# EAGLE design RobotBooster (EAGLE 6.4)
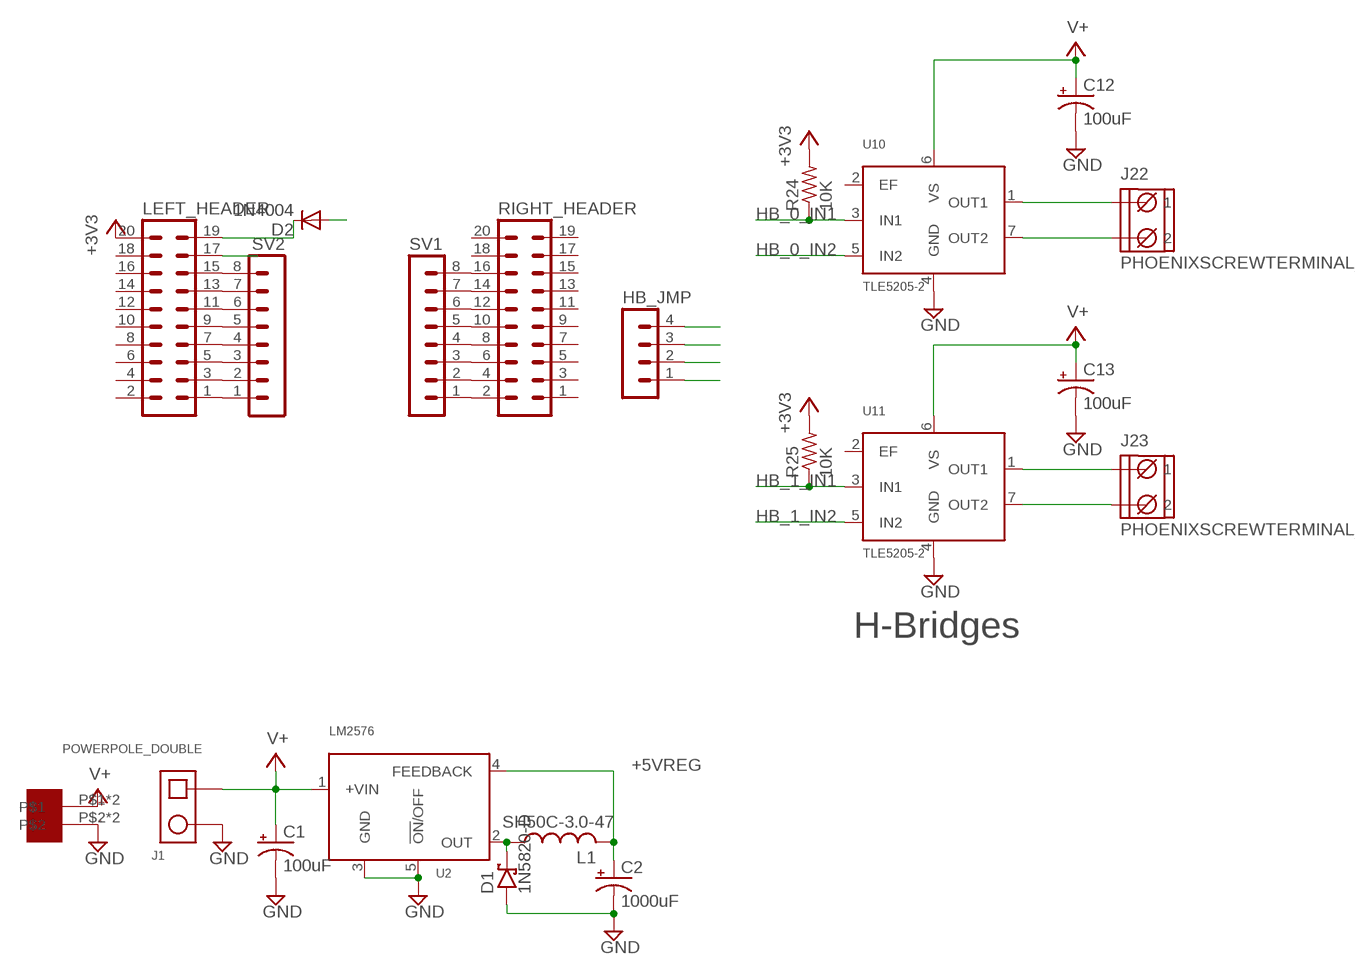
[diagram p0: schematic, sheet 1]

## Parts
C1  100uF  CPOL-USE3.5-8  [E3,5-8]
C2  1000uF  CPOL-USE5-10.5  [E5-10,5]
C12  100uF  CPOL-USE3.5-8  [E3,5-8]
C13  100uF  CPOL-USE3.5-8  [E3,5-8]
D1  1N5820-D  [DIODE_17MM]
D2  1N4004  [DO41-10]
HB_JMP  MA04-1  [MA04-1]
J1  POWERPOLE_DOUBLE  [POWERPOLE_DOUBLE]
J22  PHOENIXSCREWTERMINAL_2  [PHOENIXSCREWTERMINAL_2]
J23  PHOENIXSCREWTERMINAL_2  [PHOENIXSCREWTERMINAL_2]
L1  SH50C-3.0-47  [SH50-C2]
LEFT_HEADER  MA10-2  [MA10-2]
R24  10K  R-US_0204/5  [0204/5]
R25  10K  R-US_0204/5  [0204/5]
RIGHT_HEADER  MA10-2  [MA10-2]
SV1  MA08-1  [MA08-1]
SV2  MA08-1  [MA08-1]
U2  LM2576  [TO-220-5]
U10  TLE5205-2  [TO-220-7-11]
U11  TLE5205-2  [TO-220-7-11]
U$1  .200-2SMD  [HLE-108-02-X-DV-BE-A]

## Nets
+3V3: LEFT_HEADER.20 R24.2 R25.2
+5VREG: C2.+ D2.A L1.P$2 U2.4(FEEDBACK)
GND: C1.- C2.- C12.- C13.- D1.2(A) J1.2 LEFT_HEADER.17 U2.3(GND) U2.5(!ON!/OFF) U10.4(GND) U11.4(GND) U$1.P$2 U$1.P$4
HB_0_IN1: HB_JMP.4 R24.1 U10.3(IN1)
HB_0_IN2: HB_JMP.3 U10.5(IN2)
HB_1_IN1: HB_JMP.2 R25.1 U11.3(IN1)
HB_1_IN2: HB_JMP.1 U11.5(IN2)
N$1: D1.1(C) L1.P$1 U2.2(OUT)
N$2: RIGHT_HEADER.2 SV1.1
N$3: RIGHT_HEADER.4 SV1.2
N$4: RIGHT_HEADER.6 SV1.3
N$5: RIGHT_HEADER.8 SV1.4
N$6: RIGHT_HEADER.10 SV1.5
N$7: RIGHT_HEADER.12 SV1.6
N$8: RIGHT_HEADER.14 SV1.7
N$9: RIGHT_HEADER.16 SV1.8
N$10: LEFT_HEADER.1 SV2.1
N$11: LEFT_HEADER.3 SV2.2
N$12: LEFT_HEADER.5 SV2.3
N$13: LEFT_HEADER.7 SV2.4
N$14: LEFT_HEADER.9 SV2.5
N$15: LEFT_HEADER.11 SV2.6
N$16: LEFT_HEADER.13 SV2.7
N$17: LEFT_HEADER.15 SV2.8
N$18: D2.C LEFT_HEADER.19
N$24: J22.1 U10.1(OUT1)
N$27: J22.2 U10.7(OUT2)
N$28: J23.1 U11.1(OUT1)
N$31: J23.2 U11.7(OUT2)
V+: C1.+ C12.+ C13.+ J1.1 U2.1(+VIN) U10.6(VS) U11.6(VS) U$1.P$1 U$1.P$3
Unconnected: LEFT_HEADER.2 LEFT_HEADER.4 LEFT_HEADER.6 LEFT_HEADER.8 LEFT_HEADER.10 LEFT_HEADER.12 LEFT_HEADER.14 LEFT_HEADER.16 LEFT_HEADER.18 RIGHT_HEADER.1 RIGHT_HEADER.3 RIGHT_HEADER.5 RIGHT_HEADER.7 RIGHT_HEADER.9 RIGHT_HEADER.11 RIGHT_HEADER.13 RIGHT_HEADER.15 RIGHT_HEADER.17 RIGHT_HEADER.18 RIGHT_HEADER.19 RIGHT_HEADER.20 U10.2(EF) U11.2(EF)

## Notes on the sheet
- H-Bridges

## Library data of the parts
C1 C2 C12 C13 = rcl:CPOL-US: POLARIZED CAPACITOR, American symbol
D1 = RASEagleLib:1N5820-D: 1N5820-D Schottky Diode
D2 = diode:1N4004: DIODE general purpose rectifier, 1 A
HB_JMP = con-lstb:MA04-1: PIN HEADER; OC_FARNELL: unknown; OC_NEWARK: unknown
J1 = RASEagleLib:POWERPOLE_DOUBLE: Double PowerPole Connector Good for battery connections.
J22 J23 = RASEagleLib:PHOENIXSCREWTERMINAL_2: Phoenix Screw Terminal 2 contacts, 5 mm pitch Terminal: 1934861 Pins: 1933189
L1 = RASEagleLib:SH50C-3.0-47: Inductor 47uH, 3 A SH50C-3.0-47
LEFT_HEADER RIGHT_HEADER = con-lstb:MA10-2: PIN HEADER; OC_FARNELL: unknown; OC_NEWARK: unknown
R24 R25 = rcl:R-US_: RESISTOR, American symbol
SV1 SV2 = con-lstb:MA08-1: PIN HEADER; OC_FARNELL: unknown; OC_NEWARK: unknown
U2 = RASEagleLib:LM2576: LM2576 Step Down Regulator
U10 U11 = RASEagleLib:TLE5205-2: TLE5205-2 5-A H-Bridge for DC-Motor Applications
U$1 = HPM-02-02-T-S:.200-2SMD

## Board
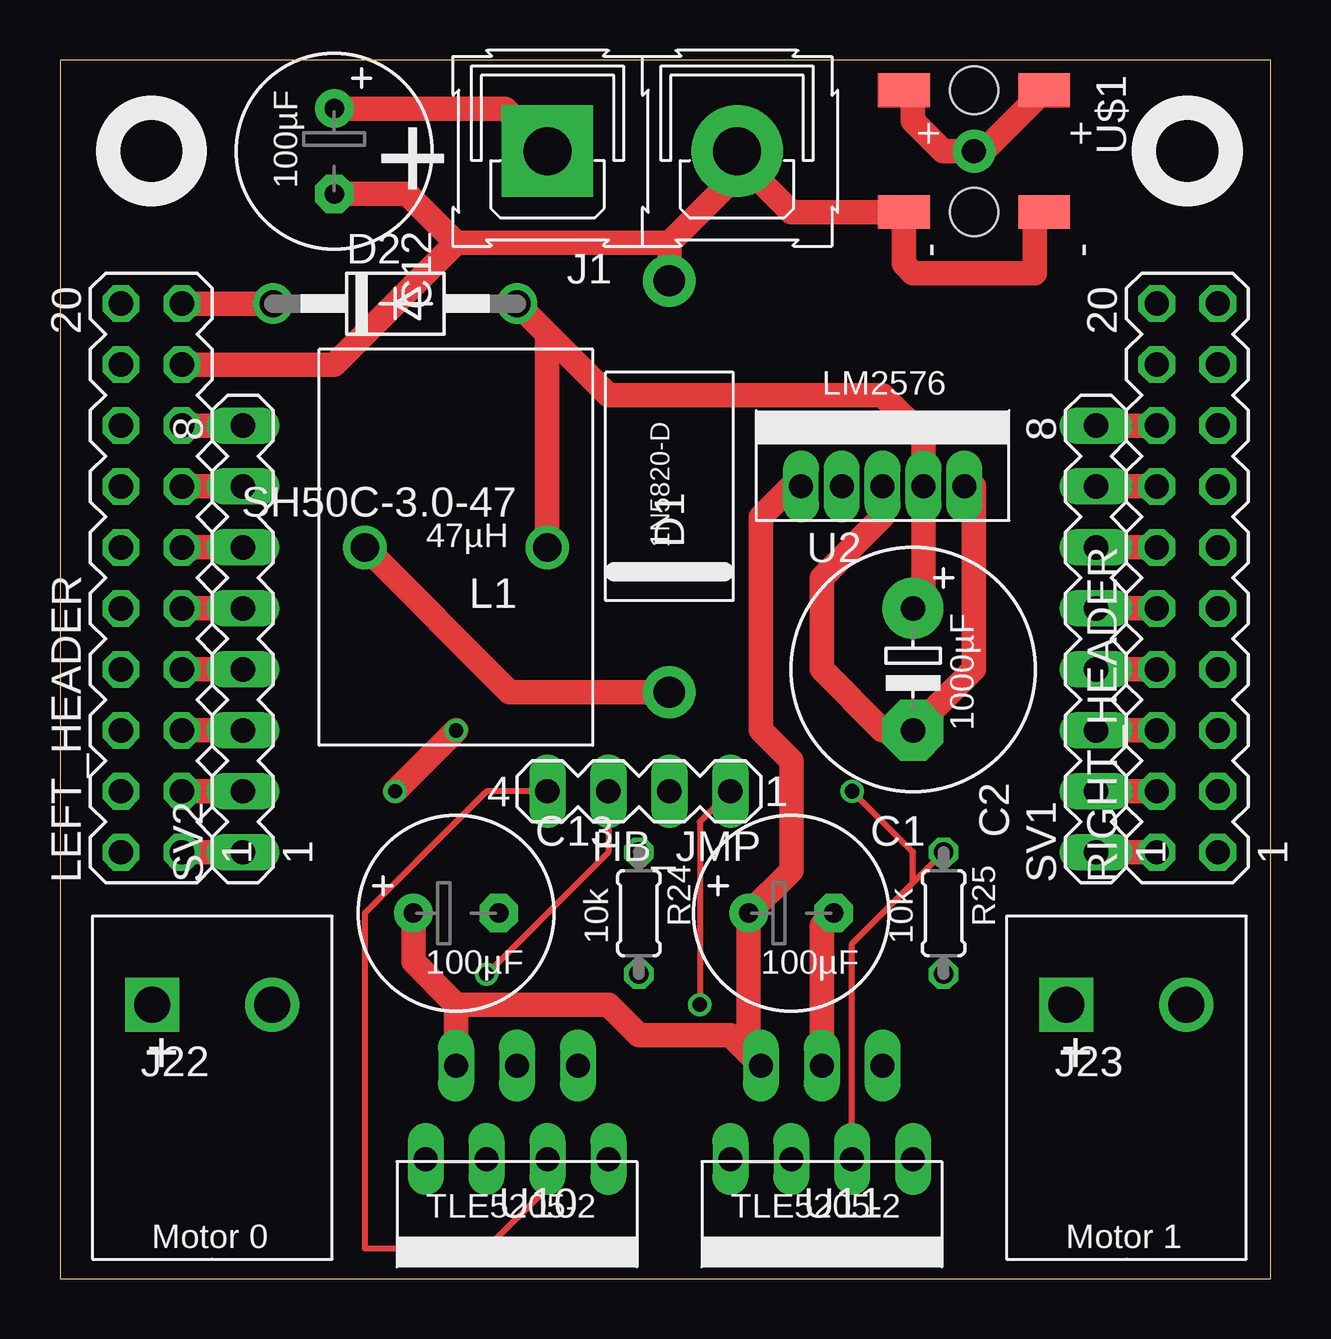
[diagram p1: board, top side]
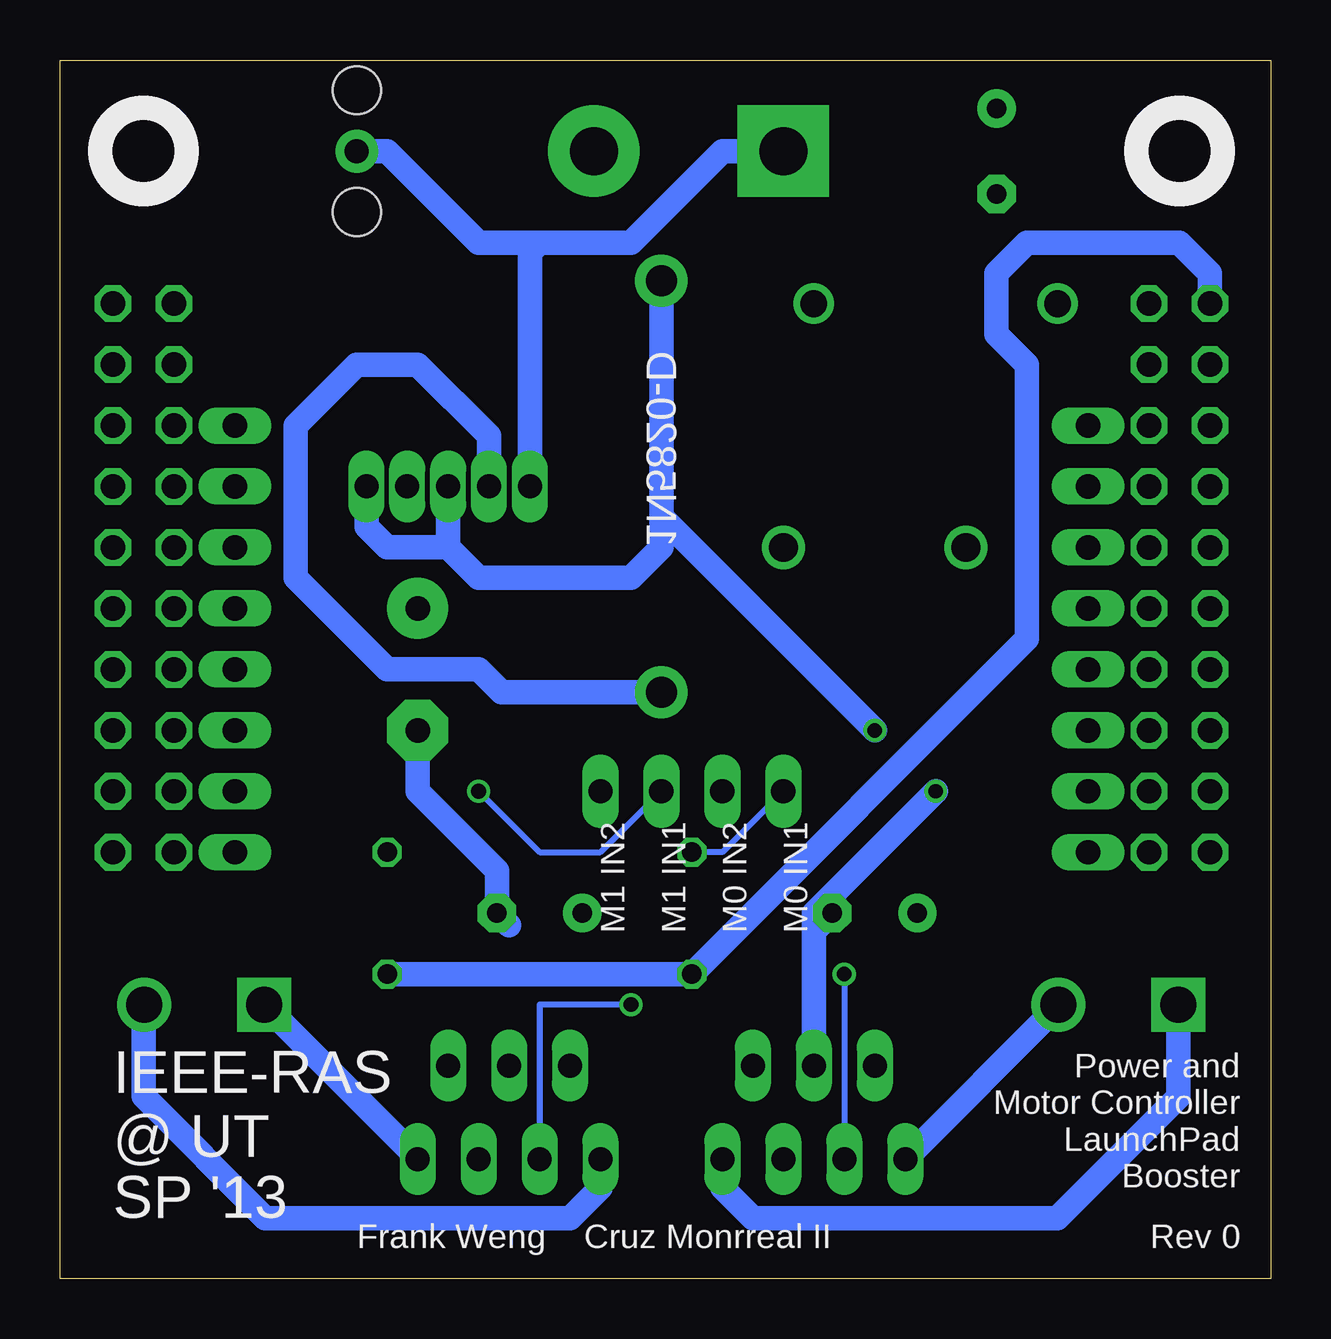
[diagram p2: board, bottom side, seen from below]

Size 50.47 x 50.79 mm. Coordinates in mm from the lower left corner, seen from the top.
Outline: 0,0 50.47,0 50.47,50.79 0,50.79 0,0
Copper layers (1*16): Top 0.0356mm / dielectric 1.5011mm / Bottom 0.0356mm
Design rules "OSHPark": minimum track width 6mil, minimum drill 13mil, track to track 6mil, track to pad 6mil, pad to pad 6mil, via to via 6mil, smd to smd 6mil, copper to edge 15mil, drill to drill 6mil, minimum pad ring 7mil, minimum via ring 7mil, stop-mask expansion 4mil, vias tented up to drill 16mil, thermal gap 10mil
Holes 3.2 mm at 3.81,46.99 46.99,46.99

### Footprints (pad centres in the part's own frame; a part is rotated, then mirrored left to right if it is on the bottom)
E3,5-8 = drill 0.813 pad 1.6: + -1.778,0 | drill 0.813 pad 1.6 octagon: - 1.778,0
E5-10,5 = drill 1.016 pad 2.54: + -2.54,0 | drill 1.016 pad 2.54 octagon: - 2.54,0
DIODE_17MM = drill 1.3 pad 2.184: 1 -8.572,0; 2 8.572,0
DO41-10 = drill 1.118: A 5.08,0; C -5.08,0
MA04-1 = drill 1.016 long: 1 -3.81,0; 2 -1.27,0; 3 1.27,0; 4 3.81,0
POWERPOLE_DOUBLE = drill 2 pad 3.81 square: 1 0,0 | drill 2 pad 3.81: 2 7.9,0
PHOENIXSCREWTERMINAL_2 = drill 1.5 square: 1 -2.5,0 | drill 1.5: 2 2.5,0
SH50-C2 = drill 1.2: P$1 3.8,0; P$2 -3.8,0
MA10-2 = drill 1.016 octagon: 1 -11.43,-1.27; 2 -11.43,1.27; 3 -8.89,-1.27; 4 -8.89,1.27; 5 -6.35,-1.27; 6 -6.35,1.27; 7 -3.81,-1.27; 8 -3.81,1.27; 9 -1.27,-1.27; 10 -1.27,1.27; 11 1.27,-1.27; 12 1.27,1.27; 13 3.81,-1.27; 14 3.81,1.27; 15 6.35,-1.27; 16 6.35,1.27; 17 8.89,-1.27; 18 8.89,1.27; 19 11.43,-1.27; 20 11.43,1.27
0204/5 = drill 0.813 octagon: 1 -2.54,0; 2 2.54,0
MA08-1 = drill 1.016 long: 1 -8.89,0; 2 -6.35,0; 3 -3.81,0; 4 -1.27,0; 5 1.27,0; 6 3.81,0; 7 6.35,0; 8 8.89,0
TO-220-5 = drill 1 long: 1 -3.404,0; 2 -1.702,0; 3 0,0; 4 1.702,0; 5 3.404,0
TO-220-7-11 = drill 1 long: 1 -3.81,3.9; 2 -2.54,0; 3 -1.27,3.9; 4 0,0; 5 1.27,3.9; 6 2.54,0; 7 3.81,3.9
HLE-108-02-X-DV-BE-A = smd 1.397 x 2.159: P$1 -2.54,2.921; P$2 2.54,2.921; P$3 -2.54,-2.921; P$4 2.54,-2.921 | hole 2: -2.54,0; 2.54,0

### Placement (x,y rotation side)
C1  30.48,15.24 0 top
C2  35.56,25.4 270 top
C12  11.43,46.99 270 top
C13  16.51,15.24 0 top
D1  25.4,33.02 90 top
D2  13.97,40.64 0 top
HB_JMP  24.13,20.32 180 top
J1  20.32,46.99 0 top
J22  6.35,11.43 0 top
J23  44.45,11.43 0 top
L1  16.51,30.48 180 top
LEFT_HEADER  3.81,29.21 90 top
R24  24.13,15.24 270 top
R25  36.83,15.24 270 top
RIGHT_HEADER  46.99,29.21 90 top
SV1  43.18,26.67 90 top
SV2  7.62,26.67 90 top
U2  34.29,33.02 0 top
U10  19.05,8.89 180 top
U11  31.75,8.89 180 top
U$1  38.1,46.99 270 top

### Tracks (layer width: path | path; a pad name or v marks a point on that pad's centre or on a via)
+3V3
  Bottom 1.016: R25.2 R24.2 10.16,26.67 10.16,38.1 11.43,39.37 11.43,41.91 10.16,43.18 3.81,43.18 2.54,41.91 LEFT_HEADER.20
+5VREG
  Top 1.016: D2.A 20.32,39.37 | 20.32,39.37 22.86,36.83 34.29,36.83 35.99,35.13 U2.4 35.99,28.37 C2.+ | L1.P$2 20.31,39.36 20.32,39.37
GND  (via drill 0.6)
  Top 1.016: U$1.P$4 30.48,44.45 28.22,46.71 J1.2 27.94,46.71 27.94,45.72 25.4,43.18 | U$1.P$4 35.56,44.45 | U$1.P$4 35.18,42.29 35.56,41.91 40.64,41.91 40.64,44.07 U$1.P$2 | C12.- 14.48,45.21 16.51,43.18 | 16.51,43.18 25.4,43.18 | D1.2 25.4,43.18 | U2.3 34.29,31.75 31.75,29.21 31.75,25.4 34.29,22.86 C2.- 38.1,25.4 38.1,33.02 | U11.4 31.75,14.73 C1.- | LEFT_HEADER.17 11.43,38.1 16.51,43.18 | v13.97,20.32 v16.51,22.86
  Bottom 1.016: U2.3 34.29,30.48 | 34.29,30.48 33.02,29.21 26.67,29.21 25.4,30.48 25.4,31.75 | 25.4,31.75 D1.2 | U10.4 19.05,14.48 | 19.05,14.48 C13.- | 31.75,14.73 C1.- 32.26,17.02 35.56,20.32 C2.- | U2.5 37.69,31.34 36.83,30.48 34.29,30.48 | 19.05,14.48 19.05,15.24 v13.97,20.32 | v16.51,22.86 25.4,31.75
HB_0_IN1
  Top 0.254: HB_JMP.4 17.78,20.32 12.7,15.24 12.7,1.27 17.78,1.27 20.32,3.81 U10.3
  Bottom 0.254: R24.1 22.86,17.78 HB_JMP.4
HB_0_IN2  (via drill 0.61)
  Top 0.254: v17.78,12.7 22.86,17.78 HB_JMP.3
  Bottom 0.254: v17.78,12.7 U10.5
HB_1_IN1  (via drill 0.61)
  Top 0.254: 35.56,16.51 33.02,13.97 U11.3 | 35.56,16.51 R25.1 | v33.02,20.32 35.56,17.78 35.56,16.51
  Bottom 0.254: HB_JMP.2 27.94,17.78 30.48,17.78 v33.02,20.32
HB_1_IN2  (via drill 0.61)
  Top 0.254: v26.67,11.43 26.67,19.05 HB_JMP.1
  Bottom 0.254: U11.5 30.48,11.43 v26.67,11.43
N$1
  Top 1.016: D1.1 18.74,24.45 L1.P$1
  Bottom 1.016: U2.2 32.59,35.13 35.56,38.1 38.1,38.1 40.64,35.56 40.64,29.21 36.83,25.4 33.02,25.4 32.07,24.45 D1.1
N$2
  Top 1.016: SV1.1 RIGHT_HEADER.2
N$3
  Top 1.016: SV1.2 RIGHT_HEADER.4
N$4
  Top 1.016: SV1.3 RIGHT_HEADER.6
N$5
  Top 1.016: SV1.4 RIGHT_HEADER.8
N$6
  Top 1.016: SV1.5 RIGHT_HEADER.10
N$7
  Top 1.016: SV1.6 RIGHT_HEADER.12
N$8
  Top 1.016: SV1.7 RIGHT_HEADER.14
N$9
  Top 1.016: SV1.8 RIGHT_HEADER.16
N$10
  Top 1.016: LEFT_HEADER.1 SV2.1
N$11
  Top 1.016: LEFT_HEADER.3 SV2.2
N$12
  Top 1.016: LEFT_HEADER.5 SV2.3
N$13
  Top 1.016: LEFT_HEADER.7 SV2.4
N$14
  Top 1.016: LEFT_HEADER.9 SV2.5
N$15
  Top 1.016: LEFT_HEADER.11 SV2.6
N$16
  Top 1.016: LEFT_HEADER.13 SV2.7
N$17
  Top 1.016: LEFT_HEADER.15 SV2.8
N$18
  Top 1.016: D2.C LEFT_HEADER.19
N$24
  Bottom 1.016: J22.1 3.85,7.58 8.89,2.54 21.59,2.54 22.86,3.81 U10.1
N$27
  Bottom 1.016: J22.2 8.85,11.38 U10.7
N$28
  Bottom 1.016: U11.1 35.56,5.04 J23.1
N$31
  Bottom 1.016: U11.7 27.94,3.81 29.21,2.54 41.91,2.54 46.99,7.62 46.99,11.39 J23.2
V+  (via drill 1 pad 1.78)
  Top 1.016: U$1.P$1 38.48,46.99 v38.1,46.99 36.83,46.99 35.56,48.26 35.56,49.15 U$1.P$3 35.56,49.53 | C12.+ 18.54,48.77 J1.1 | U2.1 30.48,33.02 29.21,31.75 29.21,22.86 30.48,21.59 30.48,17.02 C1.+ 28.7,9.4 U11.6 27.94,10.16 24.13,10.16 22.86,11.43 16.51,11.43 | C13.+ 14.73,13.21 16.51,11.43 | U10.6 16.51,11.43
  Bottom 1.016: 30.48,43.18 33.02,43.18 36.83,46.99 v38.1,46.99 | U2.1 30.89,42.77 30.48,43.18 | J1.1 22.86,46.99 26.67,43.18 30.48,43.18

### Text on the board
tPlace: 100µF | + | LM2576 | 47µH | 1N5820-D | 1000µF | 10k | 10k | 100µF | 100µF | + | + | TLE5205-2 | TLE5205-2 | Motor 0 | Motor 1
bPlace: M0 IN1 | M0 IN2 | M1 IN1 | M1 IN2 | IEEE-RAS / @ UT | Power and / Motor Controller / LaunchPad / Booster | SP '13 | Rev 0 | Frank Weng Cruz Monrreal II